# EasyEDA Pro project ProProject_无刷编码器_2024-07-07.epro

# Schematic Schematic1
Create Date: 2024-04-09; Page Name: P1; Project Name: 无刷编码器; Schematic Name: Schematic1; Update Date: 2024-04-25; Company: 嘉立创EDA; Page Size: A4; Version: V1.0
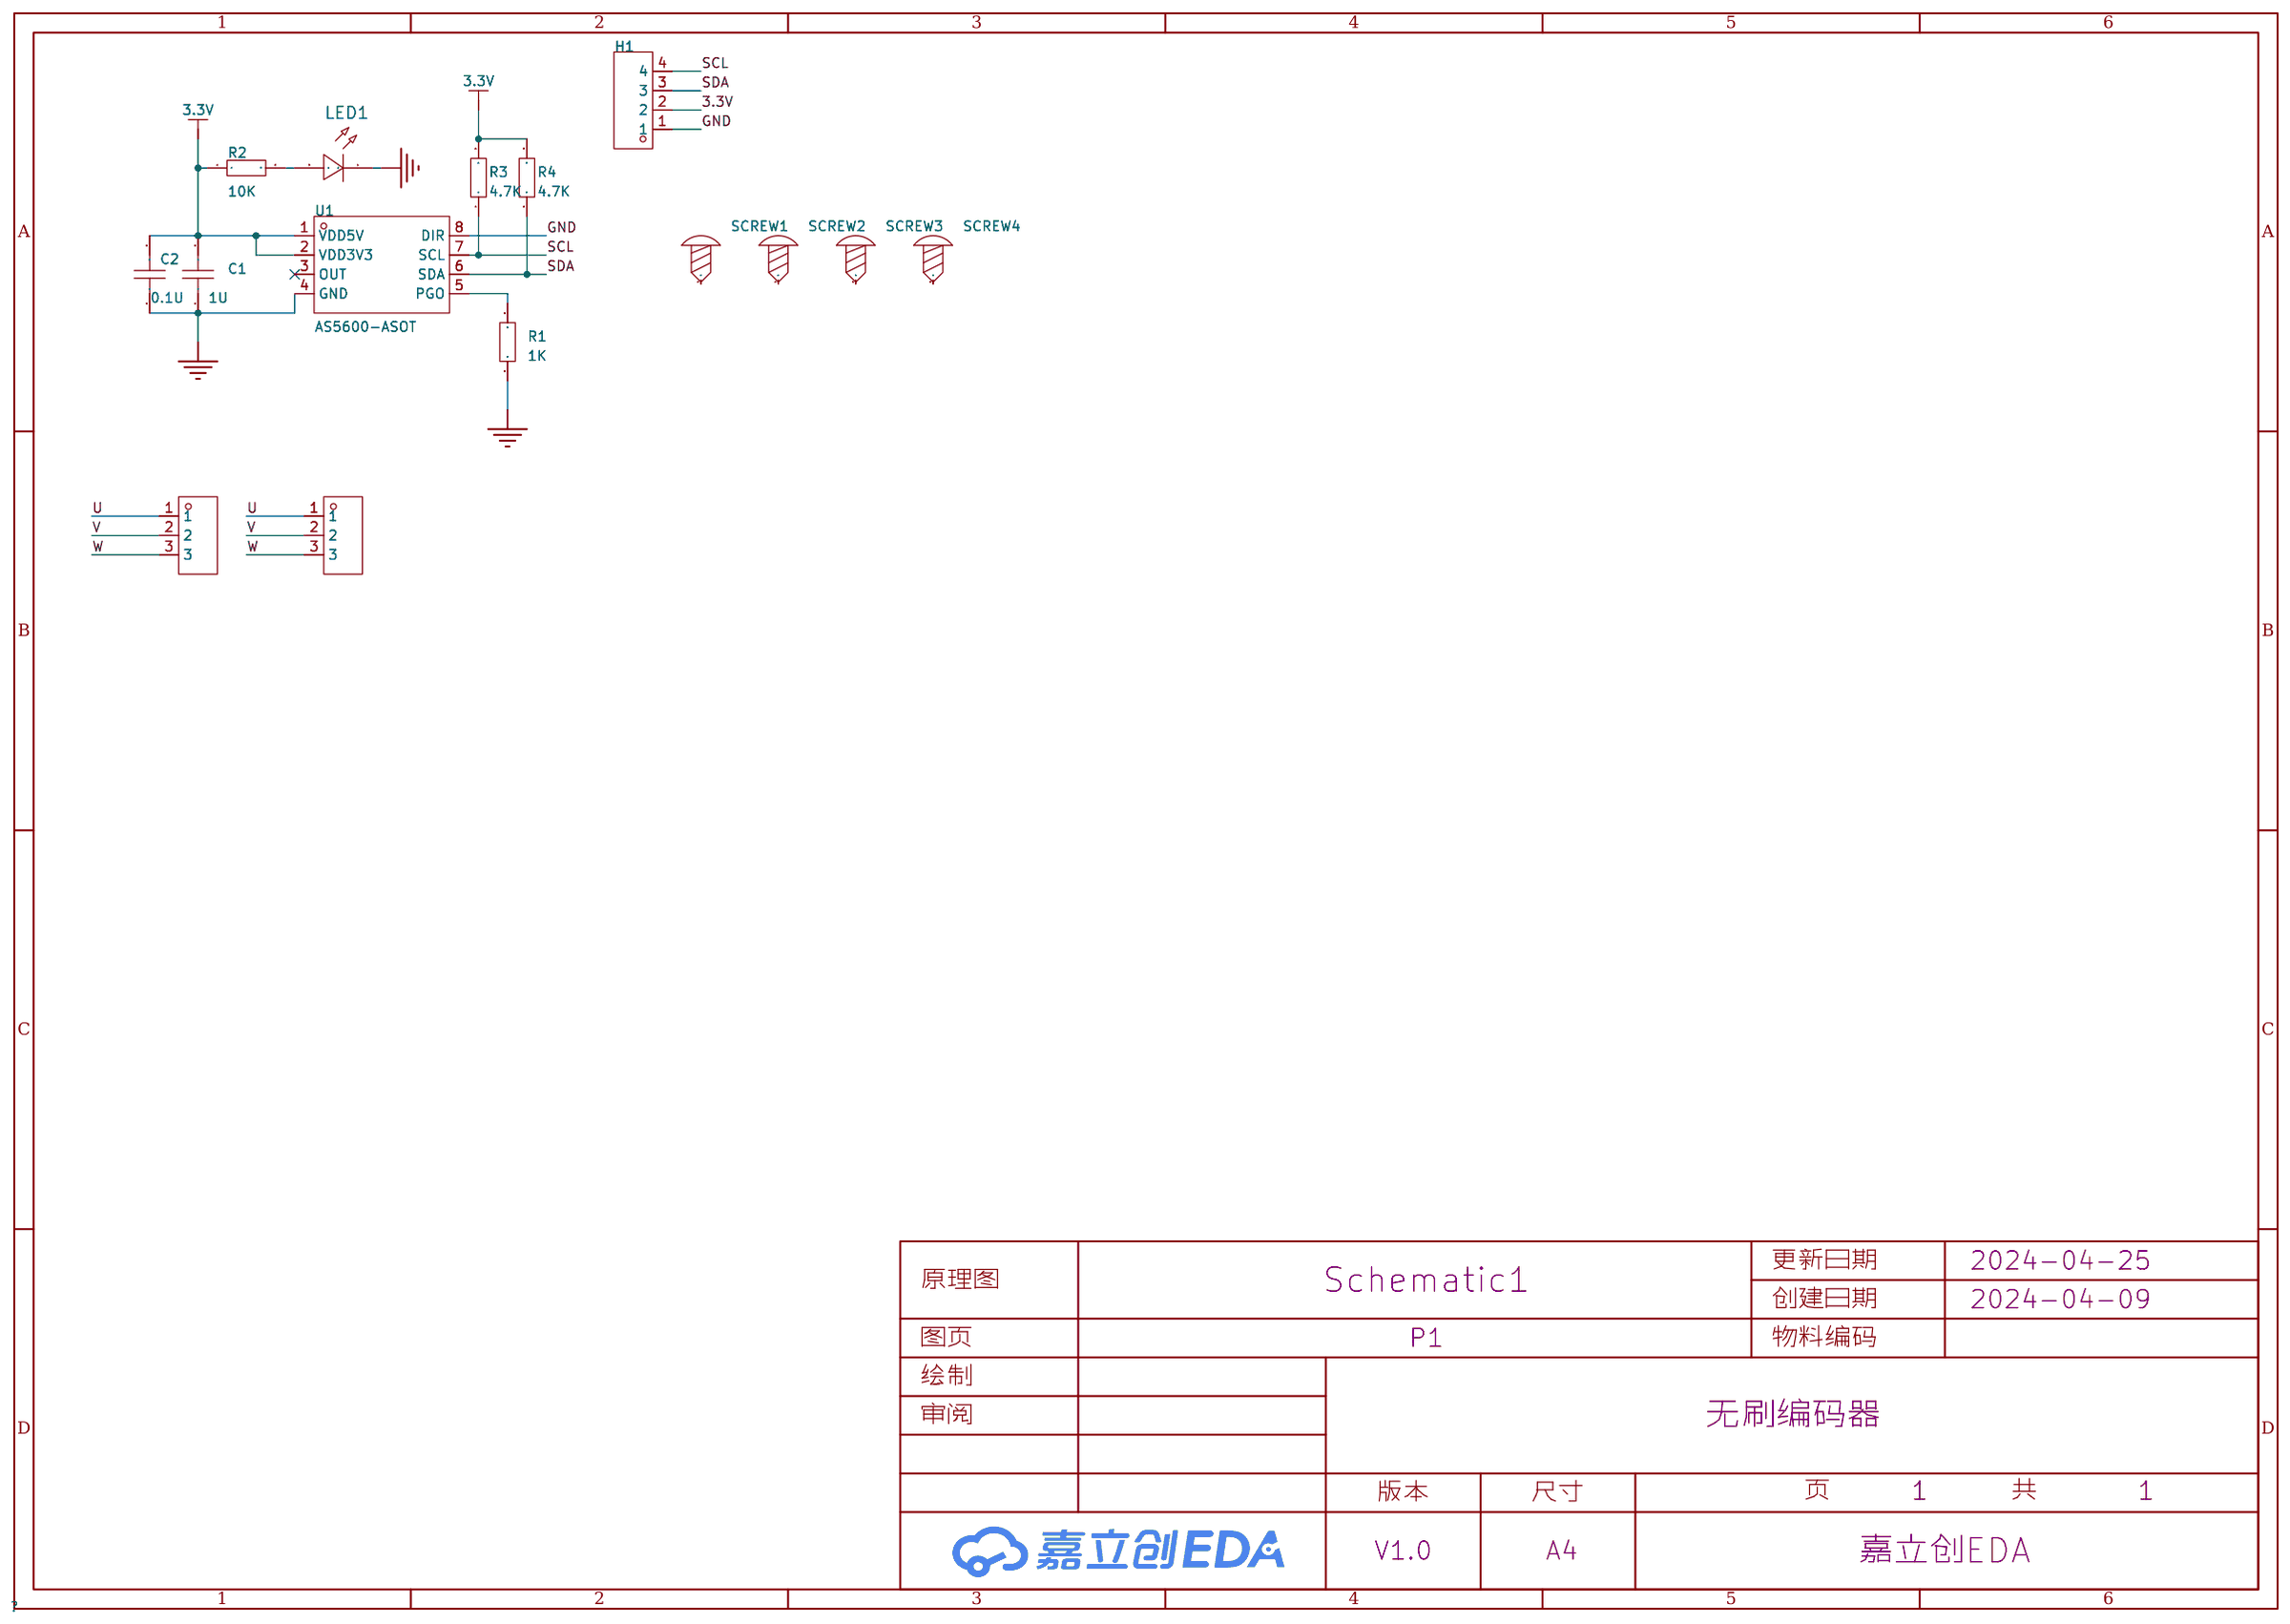
[diagram p0: schematic sheet]

## Parts
C1  1U  [C0603]
C2  0.1U  [C0603]
H1  -  [HDR-TH_4P-P2.54-V-M]
LED1  -  [LED_0603]
R1  1K  [R0603]
R2  10K  [R0603]
R3  4.7K  [R0603]
R4  4.7K  [R0603]
SCREW1  -  [M3螺丝]
SCREW2  -  [M3螺丝]
SCREW3  -  [M3螺丝]
SCREW4  -  [M3螺丝]
U1  AS5600-ASOT  [SOIC-8_L5.0-W4.0-P1.27-LS6.0-BL]
U11  KF301-5.0-3P  [CONN-TH_3P-P5.00_KF301-5.0-3P]
U12  KF301-5.0-3P  [CONN-TH_3P-P5.00_KF301-5.0-3P]

## Library data of the parts
C1 C2 = CAP_0603: Supplier Footprint: 0603
H1 = HDR-M_2.54_1x4P: Supplier Part: C492403; Supplier Footprint: 插件
LED1 = LED_0603-R: Supplier Footprint: 0603
R1-R4 = Res_0603: Supplier Footprint: 0603
SCREW1-SCREW4 = M3螺丝: Supplier Footprint: 插件
U1 = AS5600-ASOT: 旋转角度范围:0°~360°;; Supplier Part: C499458; Manufacturer: ams(艾迈斯半导体); Supplier Footprint: SOIC-8; JLCPCB Part Class: 扩展库; Datasheet: https://atta.szlcsc.com/upload/public/pdf/source/20200324/C499458_E1461AFB0CE1042DE5756821C534625C.pdf; Supplier: LCSC; Supply Voltage: 5V；3.3V; Rotation Angle: 0°~360°
U11 U12 = KF301-5.0-3P: 结构:1x3P;间距:5mm;颜色:蓝色;安装方式:直插;额定电流:17A;额定电压:250V;排数:1;线规 - AWG:14~22;线规 - 平方毫米:1.5;每排PIN数:3;工作温度范围:-30℃~+120℃;; LCSC Part Name: 5mm 1x3P 排数:1 每排P数:3 直插; Supplier Part: C474882; Manufacturer: KEFA(科发); Supplier Footprint: 插件,P=5mm; JLCPCB Part Class: 扩展库; Datasheet: https://atta.szlcsc.com/upload/public/pdf/source/20230317/03A5B5FC229D6F9225E8F51DA1A4E80A.pdf; Supplier: LCSC; Structure: 1x3P; Pitch: 5mm; Color: 蓝色; Mounting Style: 直插; Current Rating (Max): 17A; Voltage Rating (Max): 250V; Number of Pins: 3P; Number of Rows: 1; Wire Gauge - AWG: 14~22; Wire Gauge - mm2: 1.5; Number of PINs Per Row: 3; Operating Temperature Range: -30℃~+120℃

## Nets
3.3V: C1.2 C2.2 H1.2 R2.1 R3.2 R4.2 U1.1(VDD5V) U1.2(VDD3V3)
GND: C1.1 C2.1 H1.1 LED1.1(C) R1.1 U1.4(GND) U1.8(DIR)
SCL: H1.4 R3.1 U1.7(SCL)
SDA: H1.3 R4.1 U1.6(SDA)
U: U11.1 U12.1
V: U11.2 U12.2
W: U11.3 U12.3
$1N349: R1.2 U1.5(PGO)
$1N442: LED1.2(A) R2.2

Not connected (* = marked no-connect by the designer): SCREW1 1; SCREW2 1; SCREW3 1; SCREW4 1; U1 3(OUT)*

# Board PCB1
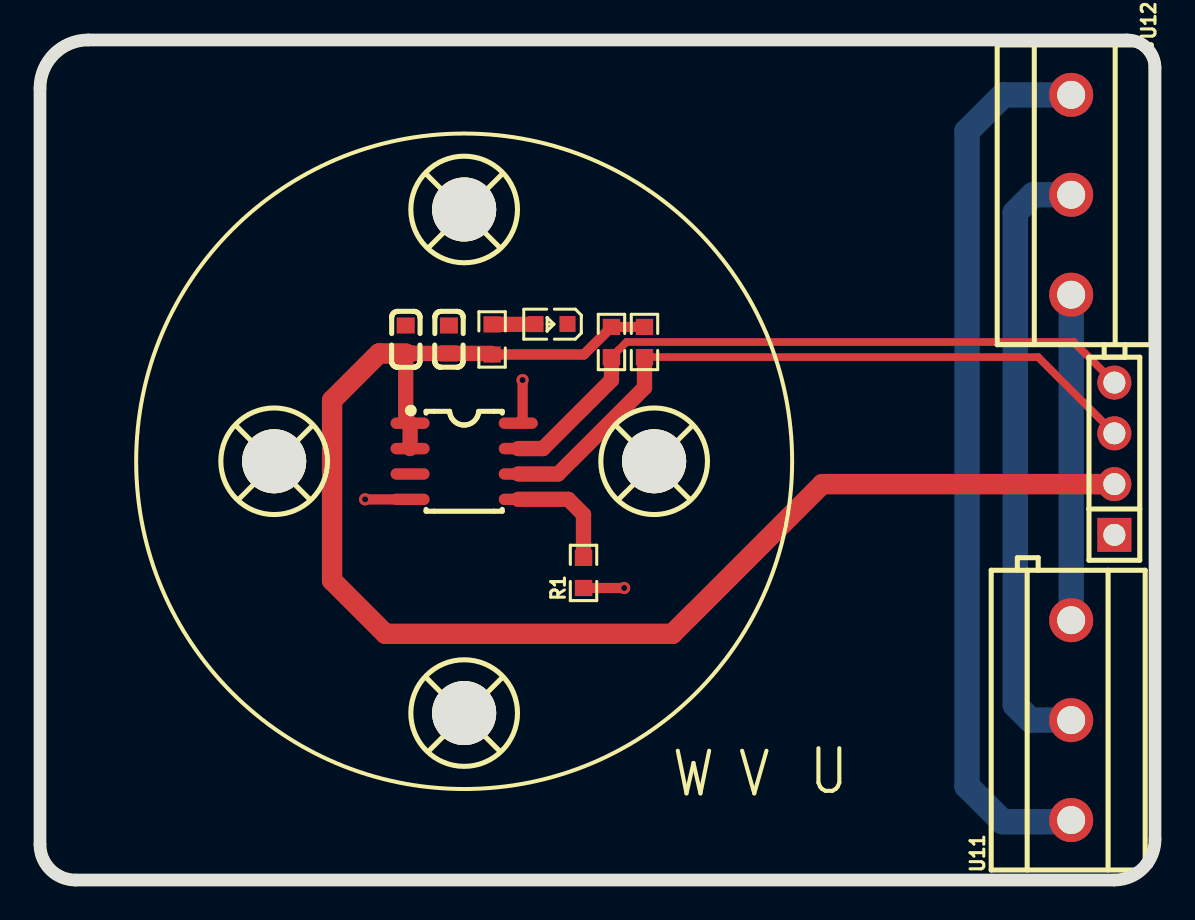
[diagram p1: board, top side]
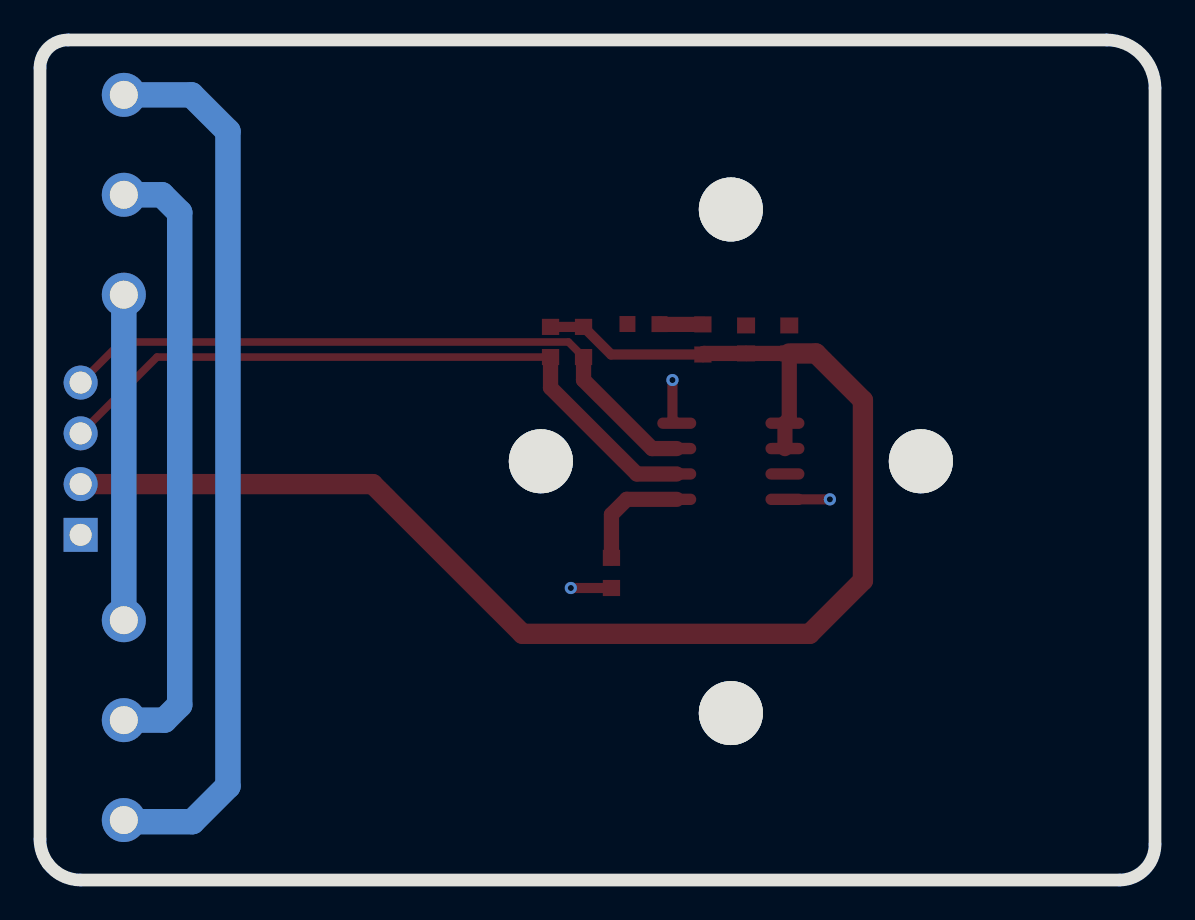
[diagram p2: board, bottom side, seen from below]

Outline 55.75 x 42.04 mm; copper layers: Top Layer, Bottom Layer. Coordinates in mm from the lower left corner of the outline.
Outline path: 0,39.62 arc(0.71,41.33) 2.41,42.04 54.36,42.04 arc(55.34,41.63) 55.75,40.64 55.75,2.03 arc(55.65,1.39) 55.35,0.82 arc(54.63,0.21) 53.72,0 1.78,0 arc(0.52,0.52) 0,1.78 0,39.62
Stack: Top Layer 0.035mm / Dielectric1 1.51mm FR4 er 4.5 / Bottom Layer 0.035mm

## Design rules (mm)
template: JLCPCB Capability(Two Layers Board)
spacing copperThickness1oz (default): track to track 0.102, other pairs 0.152 to 0.3
spacing copperThickness2oz: track to track 0.203, other pairs 0.152 to 0.3
track width copperThickness1oz (default): min 0.127, default 0.254, max 2.54
track width copperThickness2oz: min 0.203, default 0.254, max 2.54
differential pair differentialPair (default): width min 0.127, default 0.254, max 2.54; gap min 0.152, default 0.152
via viaSize (default): diameter min 0.5, default 0.61, max 10; hole min 0.3, default 0.305, max 6.3

## Placement (name value [footprint] x y rotation side)
C1  1U  [C0603]  20.45 27.05 270 top
C2  0.1U  [C0603]  18.29 27.05 270 top
H1  -  [HDR-TH_4P-P2.54-V-M]  53.72 21.08 90 top
LED1  -  [LED_0603]  25.53 27.81 180 top
R1  1K  [R0603]  27.18 15.37 90 top
R2  10K  [R0603]  22.61 27.05 90 top
R3  4.7K  [R0603]  28.58 26.92 90 top
R4  4.7K  [R0603]  30.23 26.92 90 top
SCREW1  -  [M3螺丝]  21.27 33.49 0 top
SCREW2  -  [M3螺丝]  11.77 20.89 0 top
SCREW3  -  [M3螺丝]  30.77 20.89 0 top
SCREW4  -  [M3螺丝]  21.27 8.29 0 top
U1  AS5600-ASOT  [SOIC-8_L5.0-W4.0-P1.27-LS6.0-BL]  21.21 20.96 270 top
U11  KF301-5.0-3P  [CONN-TH_3P-P5.00_KF301-5.0-3P]  51.56 8 90 top
U12  KF301-5.0-3P  [CONN-TH_3P-P5.00_KF301-5.0-3P]  51.56 34.29 270 top

## Footprints (pads in the part's own frame, mm; a bottom-side part is the same pattern mirrored in y, then rotated)
C0603
  rect 0.8x0.9 smd: 1(-0.7,0) 2(0.7,0)
CONN-TH_3P-P5.00_KF301-5.0-3P
  round 2.2 hole 1.4: 1(-5,0) 2(0,0) 3(5,0)
HDR-TH_4P-P2.54-V-M
  rect 1.7x1.7 hole 1.1: 1(-3.81,0)
  round 1.7 hole 1.1: 2(-1.27,0) 3(1.27,0) 4(3.81,0)
LED_0603
  rect 0.8x0.8 smd: 1(-0.851,-0.01) 2(0.75,-0.005)
M3螺丝
  round 3.2 hole 3.2: 1(-0.064,0.064)
R0603
  rect 0.806x0.864 smd: 1(-0.753,0) 2(0.753,0)
SOIC-8_L5.0-W4.0-P1.27-LS6.0-BL
  oval 0.569x1.95 smd: 1(-1.905,-2.705) 2(-0.635,-2.705) 3(0.635,-2.705) 4(1.905,-2.705) 5(1.905,2.705) 6(0.635,2.705) 7(-0.635,2.705) 8(-1.905,2.705)

## Nets
As in the schematic.

Pads without a net: SCREW1 1; SCREW2 1; SCREW3 1; SCREW4 1; U1 3

## Via types
v1: diameter 0.61, hole 0.305, Top Layer to Bottom Layer, 3 vias

## Routing (per net, layer and track width the routed paths; a pad name or vN(x,y) marks a point on that pad's centre or on a via; arc(x,y) is an arc through that point)
3.3V: length 74.4
  Top Layer w0.508: R4.2 R3.2 27.2,26.3 R2.1
  Top Layer w0.762: R2.1 22.55,26.35 C1.2 C2.2 18.29,23.08 U1.1 U1.2
  Top Layer w1.016: C2.2 16.95,26.35 14.6,24 14.6,14.99 17.27,12.32 31.62,12.32 39.12,19.81 H1.2
GND: length 6.5
  Top Layer w0.508: R1.1 v1(29.21,14.61) ; v1(24.13,25.02) 24.13,23.08 U1.8 ; U1.4 v1(16.26,19.05)
  Bottom Layer w0.508: v1(29.21,14.61) 29.21,14.61
SCL: length 33.5
  Top Layer w0.381: R3.1 29.33,26.92 51.69,26.92 H1.4
  Top Layer w0.762: R3.1 28.58,25.02 25.15,21.59 U1.7
SDA: length 34.7
  Top Layer w0.381: H1.3 49.9,26.17 R4.1
  Top Layer w0.762: R4.1 30.23,24.64 25.91,20.32 U1.6
U: length 44.7
  Bottom Layer w1.27: U11.1 51.48,2.92 48.13,2.92 46.35,4.7 46.35,37.47 48.18,39.29 U12.1
V: length 30.9
  Bottom Layer w1.27: U12.2 49.66,34.29 48.77,33.4 48.77,8.76 49.53,8 U11.2
W: length 16.3
  Bottom Layer w1.27: U12.3 U11.3
$1N349: length 5.7
  Top Layer w0.762: U1.5 26.42,19.05 27.18,18.29 R1.2
$1N442: length 2.2
  Top Layer w0.762: R2.2 24.76,27.8 LED1.2

## Copper pours and planes (outline as drawn; the poured copper is in the pictures)
GND on Top Layer: -0.51,43.56 56.39,43.56 56.39,-0.63 -0.51,-0.63
GND on Bottom Layer: -1.14,46.36 58.55,46.36 58.55,-2.41 -1.14,-2.41

## Text on the board
Top Silkscreen Layer: W | V | U
